# Altium project eDP_adapter_dvt1.PrjPcb
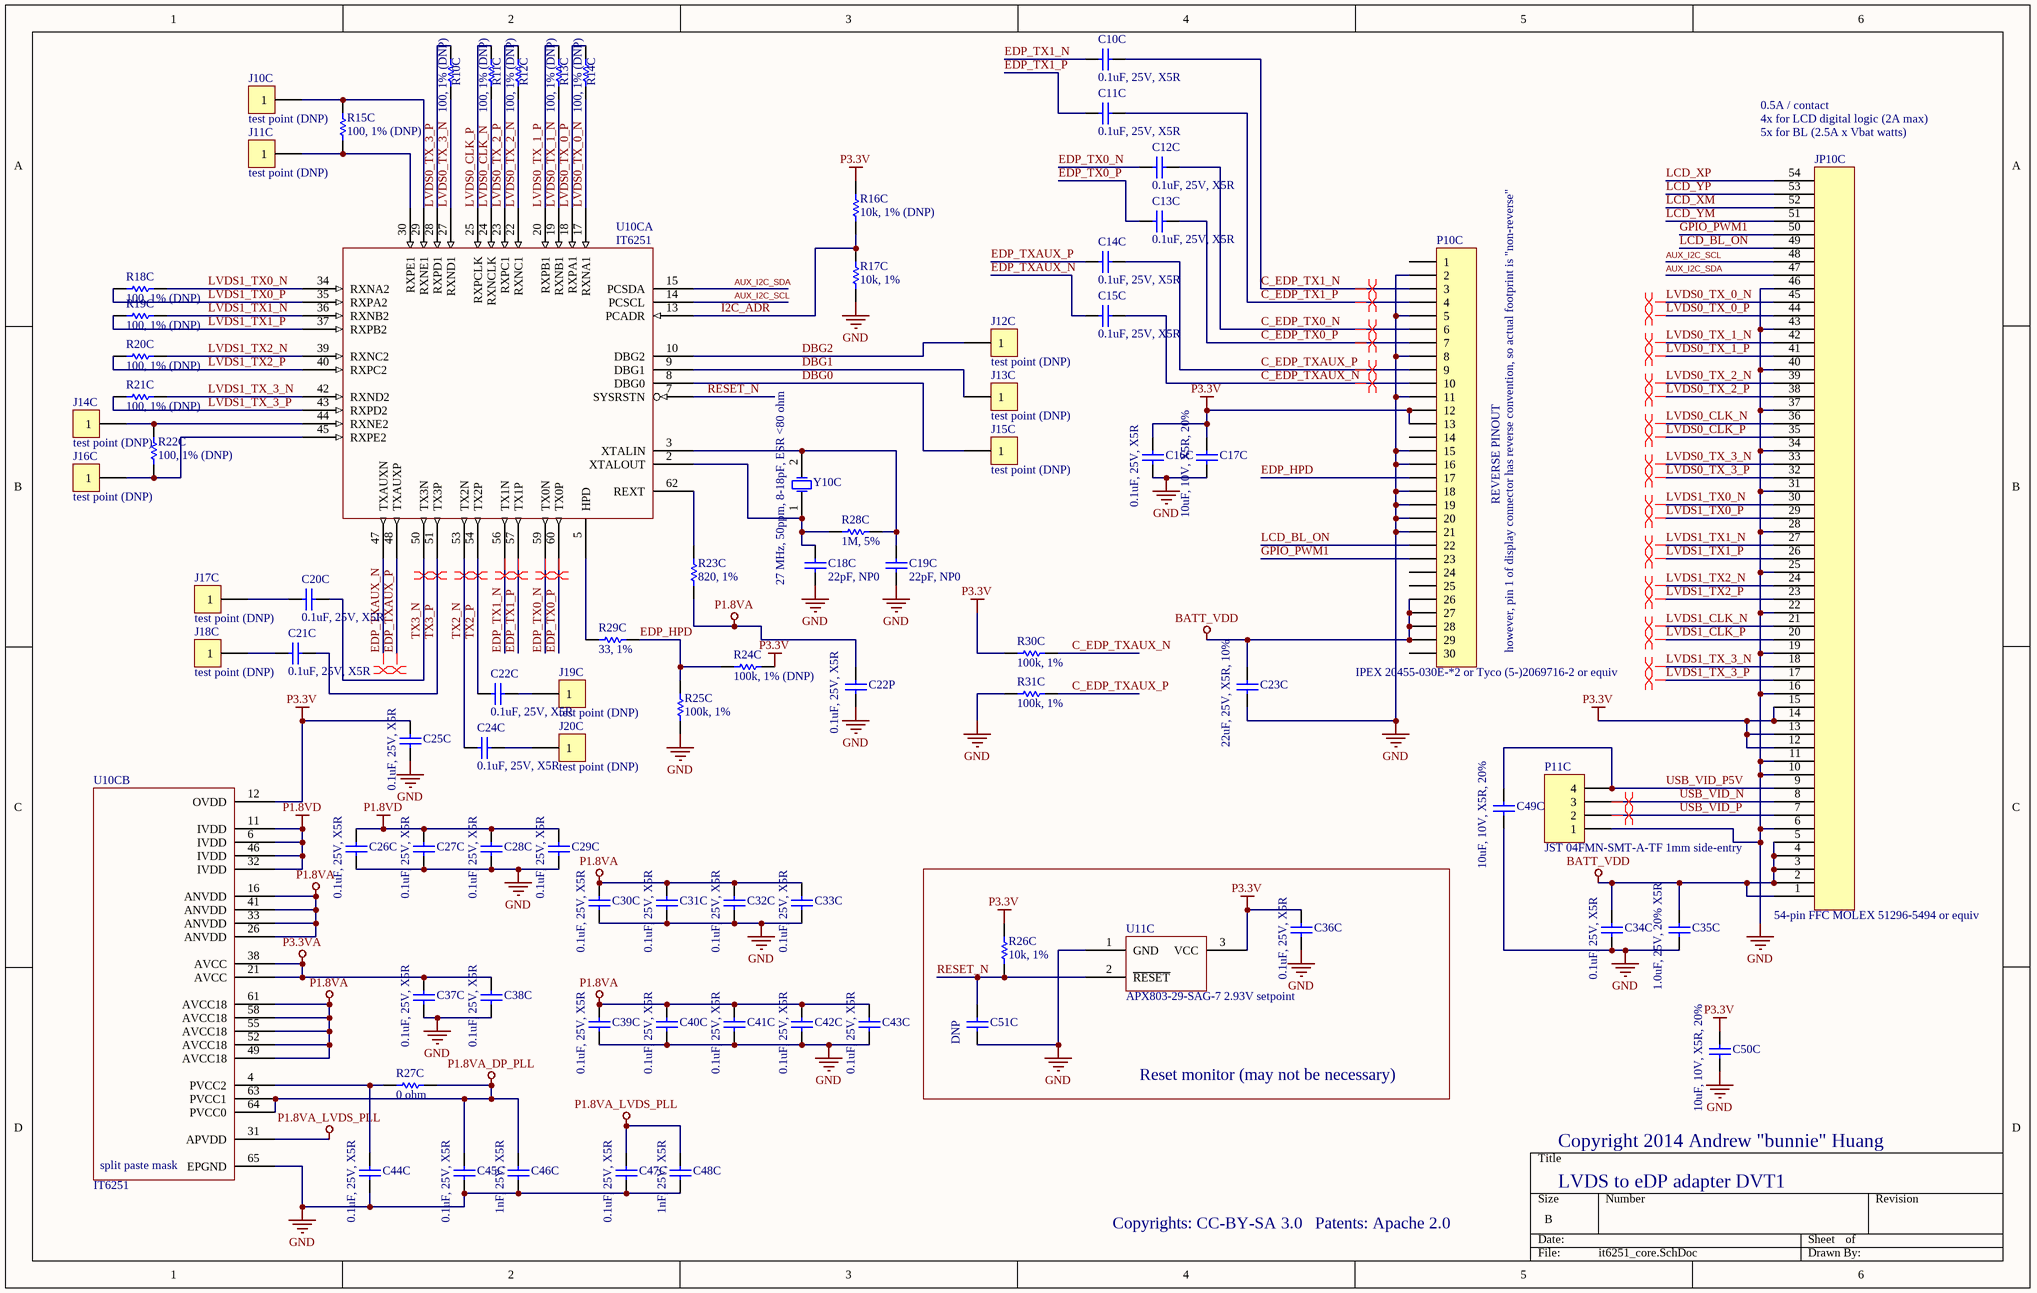
[diagram p0: it6251_core.SchDoc]
2 sheets, 112 parts. Net scope: global (net labels, ports and power ports of the same name join across sheets).
Board file: eDP_adapter_dvt1.PcbDoc
Sheets:
  it6251_core.SchDoc
  power.SchDoc

## Sheet it6251_core.SchDoc
size B

### Parts
C10C  0.1uF, 25V, X5R  [CAPC1005N]
C11C  0.1uF, 25V, X5R  [CAPC1005N]
C12C  0.1uF, 25V, X5R  [CAPC1005N]
C13C  0.1uF, 25V, X5R  [CAPC1005N]
C14C  0.1uF, 25V, X5R  [CAPC1005N]
C15C  0.1uF, 25V, X5R  [CAPC1005N]
C16C  0.1uF, 25V, X5R  [CAPC1005N]
C17C  10uF, 10V, X5R, 20%  [CAPC1608N]
C18C  22pF, NP0  [CAPC1005N]
C19C  22pF, NP0  [CAPC1005N]
C20C  0.1uF, 25V, X5R  [CAPC1005N]
C21C  0.1uF, 25V, X5R  [CAPC1005N]
C22C  0.1uF, 25V, X5R  [CAPC1005N]
C22P  0.1uF, 25V, X5R  [CAPC1005N]
C23C  22uF, 25V, X5R, 10%  [CAPC3225N]
C24C  0.1uF, 25V, X5R  [CAPC1005N]
C25C  0.1uF, 25V, X5R  [CAPC1005N]
C26C  0.1uF, 25V, X5R  [CAPC1005N]
C27C  0.1uF, 25V, X5R  [CAPC1005N]
C28C  0.1uF, 25V, X5R  [CAPC1005N]
C29C  0.1uF, 25V, X5R  [CAPC1005N]
C30C  0.1uF, 25V, X5R  [CAPC1005N]
C31C  0.1uF, 25V, X5R  [CAPC1005N]
C32C  0.1uF, 25V, X5R  [CAPC1005N]
C33C  0.1uF, 25V, X5R  [CAPC1005N]
C34C  0.1uF, 25V, X5R  [CAPC1005N]
C35C  1.0uF, 25V, 20% X5R  [CAPC1608N]
C36C  0.1uF, 25V, X5R  [CAPC1005N]
C37C  0.1uF, 25V, X5R  [CAPC1005N]
C38C  0.1uF, 25V, X5R  [CAPC1005N]
C39C  0.1uF, 25V, X5R  [CAPC1005N]
C40C  0.1uF, 25V, X5R  [CAPC1005N]
C41C  0.1uF, 25V, X5R  [CAPC1005N]
C42C  0.1uF, 25V, X5R  [CAPC1005N]
C43C  0.1uF, 25V, X5R  [CAPC1005N]
C44C  0.1uF, 25V, X5R  [CAPC1005N]
C45C  0.1uF, 25V, X5R  [CAPC1005N]
C46C  1nF, 25V, X5R  [CAPC1005N]
C47C  0.1uF, 25V, X5R  [CAPC1005N]
C48C  1nF, 25V, X5R  [CAPC1005N]
C49C  10uF, 10V, X5R, 20%  [CAPC1608N]
C50C  10uF, 10V, X5R, 20%  [CAPC1608N]
C51C  DNP  [CAPC1608N]
J10C  test point (DNP)  [TP_SMT_38mil]
J11C  test point (DNP)  [TP_SMT_38mil]
J12C  test point (DNP)  [TP_SMT_38mil]
J13C  test point (DNP)  [TP_SMT_38mil]
J14C  test point (DNP)  [TP_SMT_38mil]
J15C  test point (DNP)  [TP_SMT_38mil]
J16C  test point (DNP)  [TP_SMT_38mil]
J17C  test point (DNP)  [TP_SMT_38mil]
J18C  test point (DNP)  [TP_SMT_38mil]
J19C  test point (DNP)  [TP_SMT_38mil]
J20C  test point (DNP)  [TP_SMT_38mil]
JP10C  54-pin FFC MOLEX 51296-5494 or equiv  [MOLEX_51296_5494]
P10C  IPEX 20455-030E-*2 or Tyco (5-)2069716-2 or equiv  [TYCO_5-2069716-2]
P11C  JST 04FMN-SMT-A-TF 1mm side-entry  [JST_04FMN_SMT_A_TF]
R10C  100, 1% (DNP)  [RESC0603N]
R11C  100, 1% (DNP)  [RESC0603N]
R12C  100, 1% (DNP)  [RESC0603N]
R13C  100, 1% (DNP)  [RESC0603N]
R14C  100, 1% (DNP)  [RESC0603N]
R15C  100, 1% (DNP)  [RESC0603N]
R16C  10k, 1% (DNP)  [RESC1005N]
R17C  10k, 1%  [RESC1005N]
R18C  100, 1% (DNP)  [RESC0603N]
R19C  100, 1% (DNP)  [RESC0603N]
R20C  100, 1% (DNP)  [RESC0603N]
R21C  100, 1% (DNP)  [RESC0603N]
R22C  100, 1% (DNP)  [RESC0603N]
R23C  820, 1%  [RESC1005N]
R24C  100k, 1% (DNP)  [RESC1005N]
R25C  100k, 1%  [RESC1005N]
R26C  10k, 1%  [RESC1005N]
R27C  0 ohm  [RESC1005N]
R28C  1M, 5%  [RESC1005N]
R29C  33, 1%  [RESC1005N]
R30C  100k, 1%  [RESC1005N]
R31C  100k, 1%  [RESC1005N]
U10C  IT6251  [QFN50P900X900-64WAN]  (parts A,B of 2)
U11C  APX803-29-SAG-7 2.93V setpoint  [SOT23-3N]
Y10C  27 MHz, 50ppm, 8-18pF, ESR <80 ohm  [NDK_NX5032A]

### Blocks framed on the sheet
Reset monitor (may not be necessary): C36C C51C R26C U11C

### Nets
BATT_VDD: C23C.1 C34C.1 C35C.1 JP10C.1 JP10C.2 JP10C.3 JP10C.4 JP10C.5 P10C.26 P10C.27 P10C.28 P10C.29
GND: C16C.2 C17C.1 C18C.1 C19C.1 C22P.1 C23C.2 C25C.2 C26C.2 C27C.2 C28C.2 C29C.2 C30C.2 C31C.2 C32C.2 C33C.2 C34C.2 C35C.2 C36C.2 C37C.2 C38C.2 C39C.2 C40C.2 C41C.2 C42C.2 C43C.2 C44C.2 C45C.2 C46C.2 C47C.2 C48C.2 C49C.1 C50C.1 C51C.2 JP10C.6 JP10C.10 JP10C.11 JP10C.16 JP10C.19 JP10C.22 JP10C.25 JP10C.28 JP10C.31 JP10C.34 JP10C.37 JP10C.40 JP10C.43 JP10C.46 P10C.2 P10C.5 P10C.8 P10C.11 P10C.15 P10C.16 P10C.18 P10C.19 P10C.20 P10C.21 P11C.1 R17C.2 R25C.2 R31C.2 U10C.65(EPGND) U11C.1(GND)
P1.8VA: C22P.2 C30C.1 C31C.1 C32C.1 C33C.1 C39C.1 C40C.1 C41C.1 C42C.1 C43C.1 R23C.2 U10C.16(ANVDD) U10C.26(ANVDD) U10C.33(ANVDD) U10C.41(ANVDD) U10C.49(AVCC18) U10C.52(AVCC18) U10C.55(AVCC18) U10C.58(AVCC18) U10C.61(AVCC18)
P1.8VA_DP_PLL: C45C.1 C46C.1 R27C.1 U10C.63(PVCC1) U10C.64(PVCC0)
P1.8VA_LVDS_PLL: C47C.1 C48C.1 U10C.31(APVDD)
P1.8VD: C26C.1 C27C.1 C28C.1 C29C.1 U10C.6(IVDD) U10C.11(IVDD) U10C.32(IVDD) U10C.46(IVDD)
P3.3V: C16C.1 C17C.2 C25C.1 C36C.1 C50C.2 JP10C.12 JP10C.13 JP10C.14 JP10C.15 P10C.12 P10C.13 R16C.1 R24C.1 R26C.1 R30C.2 U10C.12(OVDD) U11C.3(VCC)
P3.3VA: C37C.1 C38C.1 U10C.21(AVCC) U10C.38(AVCC)
AUX_I2C_SCL: JP10C.48 U10C.14(PCSCL)
AUX_I2C_SDA: JP10C.47 U10C.15(PCSDA)
C_EDP_TX0_N: C12C.1 P10C.6
C_EDP_TX0_P: C13C.1 P10C.7
C_EDP_TX1_N: C10C.1 P10C.3
C_EDP_TX1_P: C11C.1 P10C.4
C_EDP_TXAUX_N: C15C.1 P10C.10 R30C.1
C_EDP_TXAUX_P: C14C.1 P10C.9 R31C.1
DBG0: J15C.1 U10C.8(DBG0)
DBG1: J13C.1 U10C.9(DBG1)
DBG2: J12C.1 U10C.10(DBG2)
EDP_HPD: P10C.17 R24C.2 R25C.1 R29C.2
EDP_TX0_N: C12C.2 U10C.59(TX0N)
EDP_TX0_P: C13C.2 U10C.60(TX0P)
EDP_TX1_N: C10C.2 U10C.56(TX1N)
EDP_TX1_P: C11C.2 U10C.57(TX1P)
EDP_TXAUX_N: C15C.2 U10C.47(TXAUXN)
EDP_TXAUX_P: C14C.2 U10C.48(TXAUXP)
GPIO_PWM1: JP10C.50 P10C.23
I2C_ADR: R16C.2 R17C.1 U10C.13(PCADR)
LCD_BL_ON: JP10C.49 P10C.22
LCD_XM: JP10C.52
LCD_XP: JP10C.54
LCD_YM: JP10C.51
LCD_YP: JP10C.53
LVDS0_CLK_N: JP10C.36 R11C.2 U10C.24(RXNCLK)
LVDS0_CLK_P: JP10C.35 R11C.1 U10C.25(RXPCLK)
LVDS0_TX_0_N: JP10C.45 R14C.2 U10C.17(RXNA1)
LVDS0_TX_0_P: JP10C.44 R14C.1 U10C.18(RXPA1)
LVDS0_TX_1_N: JP10C.42 R13C.2 U10C.19(RXNB1)
LVDS0_TX_1_P: JP10C.41 R13C.1 U10C.20(RXPB1)
LVDS0_TX_2_N: JP10C.39 R12C.2 U10C.22(RXNC1)
LVDS0_TX_2_P: JP10C.38 R12C.1 U10C.23(RXPC1)
LVDS0_TX_3_N: JP10C.33 R10C.2 U10C.27(RXND1)
LVDS0_TX_3_P: JP10C.32 R10C.1 U10C.28(RXPD1)
LVDS1_CLK_N: JP10C.21
LVDS1_CLK_P: JP10C.20
LVDS1_TX0_N: JP10C.30 R18C.1 U10C.34(RXNA2)
LVDS1_TX0_P: JP10C.29 R18C.2 U10C.35(RXPA2)
LVDS1_TX1_N: JP10C.27 R19C.1 U10C.36(RXNB2)
LVDS1_TX1_P: JP10C.26 R19C.2 U10C.37(RXPB2)
LVDS1_TX2_N: JP10C.24 R20C.1 U10C.39(RXNC2)
LVDS1_TX2_P: JP10C.23 R20C.2 U10C.40(RXPC2)
LVDS1_TX_3_N: JP10C.18 R21C.1 U10C.42(RXND2)
LVDS1_TX_3_P: JP10C.17 R21C.2 U10C.43(RXPD2)
RESET_N: C51C.1 R26C.2 U10C.7(SYSRSTN) U11C.2(~{RESET})
TX2_N: C24C.2 U10C.53(TX2N)
TX2_P: C22C.2 U10C.54(TX2P)
TX3_N: C20C.1 U10C.50(TX3N)
TX3_P: C21C.1 U10C.51(TX3P)
USB_VID_N: JP10C.8 P11C.3
USB_VID_P: JP10C.7 P11C.2
USB_VID_P5V: C49C.2 JP10C.9 P11C.4
NetC18C_2: C18C.2 R28C.2 U10C.2(XTALOUT) Y10C.1(OSC1)
NetC19C_2: C19C.2 R28C.1 U10C.3(XTALIN) Y10C.2(OSC2)
NetC20C_2: C20C.2 J17C.1
NetC21C_2: C21C.2 J18C.1
NetC22C_1: C22C.1 J19C.1
NetC24C_1: C24C.1 J20C.1
NetC44C_1: C44C.1 R27C.2 U10C.4(PVCC2)
NetJ10C_1: J10C.1 R15C.2 U10C.29(RXNE1)
NetJ11C_1: J11C.1 R15C.1 U10C.30(RXPE1)
NetJ14C_1: J14C.1 R22C.2 U10C.44(RXNE2)
NetJ16C_1: J16C.1 R22C.1 U10C.45(RXPE2)
NetR23C_1: R23C.1 U10C.62(REXT)
NetR29C_1: R29C.1 U10C.5(HPD)

Not connected (* = marked no-connect by the designer): P10C 1 14 24 25 30

### Layout directives
differential pair: C_EDP_TX0_N, C_EDP_TX0_P, C_EDP_TX1_N, C_EDP_TX1_P, C_EDP_TXAUX_N, C_EDP_TXAUX_P, EDP_TX0_N, EDP_TX0_P, EDP_TX1_N, EDP_TX1_P, EDP_TXAUX_N, EDP_TXAUX_P, LVDS0_CLK_N, LVDS0_CLK_P, LVDS0_TX_0_N, LVDS0_TX_0_P, LVDS0_TX_1_N, LVDS0_TX_1_P, LVDS0_TX_2_N, LVDS0_TX_2_P, LVDS0_TX_3_N, LVDS0_TX_3_P, LVDS1_CLK_N, LVDS1_CLK_P, LVDS1_TX0_N, LVDS1_TX0_P, LVDS1_TX1_N, LVDS1_TX1_P, LVDS1_TX2_N, LVDS1_TX2_P, LVDS1_TX_3_N, LVDS1_TX_3_P, TX2_N, TX2_P, TX3_N, TX3_P, USB_VID_N, USB_VID_P

### Notes on the sheet
- 0.5A / contact
- 4x for LCD digital logic (2A max)
- (near JP10C) 5x for BL (2.5A x Vbat watts)
- REVERSE PINOUT
- however, pin 1 of display connector has reverse convention, so actual footprint is "non-reverse"
- Copyright 2014 Andrew "bunnie" Huang
- Copyrights: CC-BY-SA 3.0
- Patents: Apache 2.0
- LVDS to eDP adapter DVT1
- (in symbol IT6251, part B) split paste mask

### Library data of the parts
C10C C11C C12C C13C C14C C15C C16C C17C C18C C19C C20C C21C C22C C22P C23C C24C C25C C26C C27C C28C C29C C30C C31C C32C C33C C34C C35C C36C C37C C38C C39C C40C C41C C42C C43C C44C C45C C46C C47C C48C C49C C50C C51C = Cap Semi: Capacitor (Semiconductor SIM Model); Published: 8-Jun-2000; LatestRevisionDate: 17-Jul-2002; LatestRevisionNote: Re-released for DXP Platform.; PackageReference: C1206; Publisher: Altium Limited
J10C J11C J12C J13C J14C J15C J16C J17C J18C J19C J20C = CON1: Connector
JP10C = HEADER_54: Flat flex connector, 54 positions
P10C = Header 30: LatestRevisionDate: 17-Jul-2002; LatestRevisionNote: Re-released for DXP Platform.; Publisher: Altium Limited
P11C = Header 4: Header, 4-Pin; LatestRevisionDate: 17-Jul-2002; LatestRevisionNote: Re-released for DXP Platform.; Publisher: Altium Limited
R10C R11C R12C R13C R14C R15C R16C R17C R18C R19C R20C R21C R22C R23C R26C R27C R28C R29C = Res1: Resistor; Value: 100k; Published: 8-Jun-2000; LatestRevisionDate: 17-Jul-2002; LatestRevisionNote: Re-released for DXP Platform.; PackageReference: AXIAL-0.3; Publisher: Altium Limited
R24C R25C R30C R31C = Res1: Resistor; Published: 8-Jun-2000; LatestRevisionDate: 17-Jul-2002; LatestRevisionNote: Re-released for DXP Platform.; PackageReference: AXIAL-0.3; Publisher: Altium Limited; Value: 100k
U10C = IT6251: LVDS to eDP converter
U11C = RESET_SOT23: Reset monitor. Voltage specified by XX in P/N. Multiple vendors.
Y10C = XTAL: Crystal Oscillator; Published: 8-Jun-2000; LatestRevisionDate: 17-Jul-2002; LatestRevisionNote: Re-released for DXP Platform.; PackageReference: R38; Publisher: Altium Limited

## Sheet power.SchDoc
size A
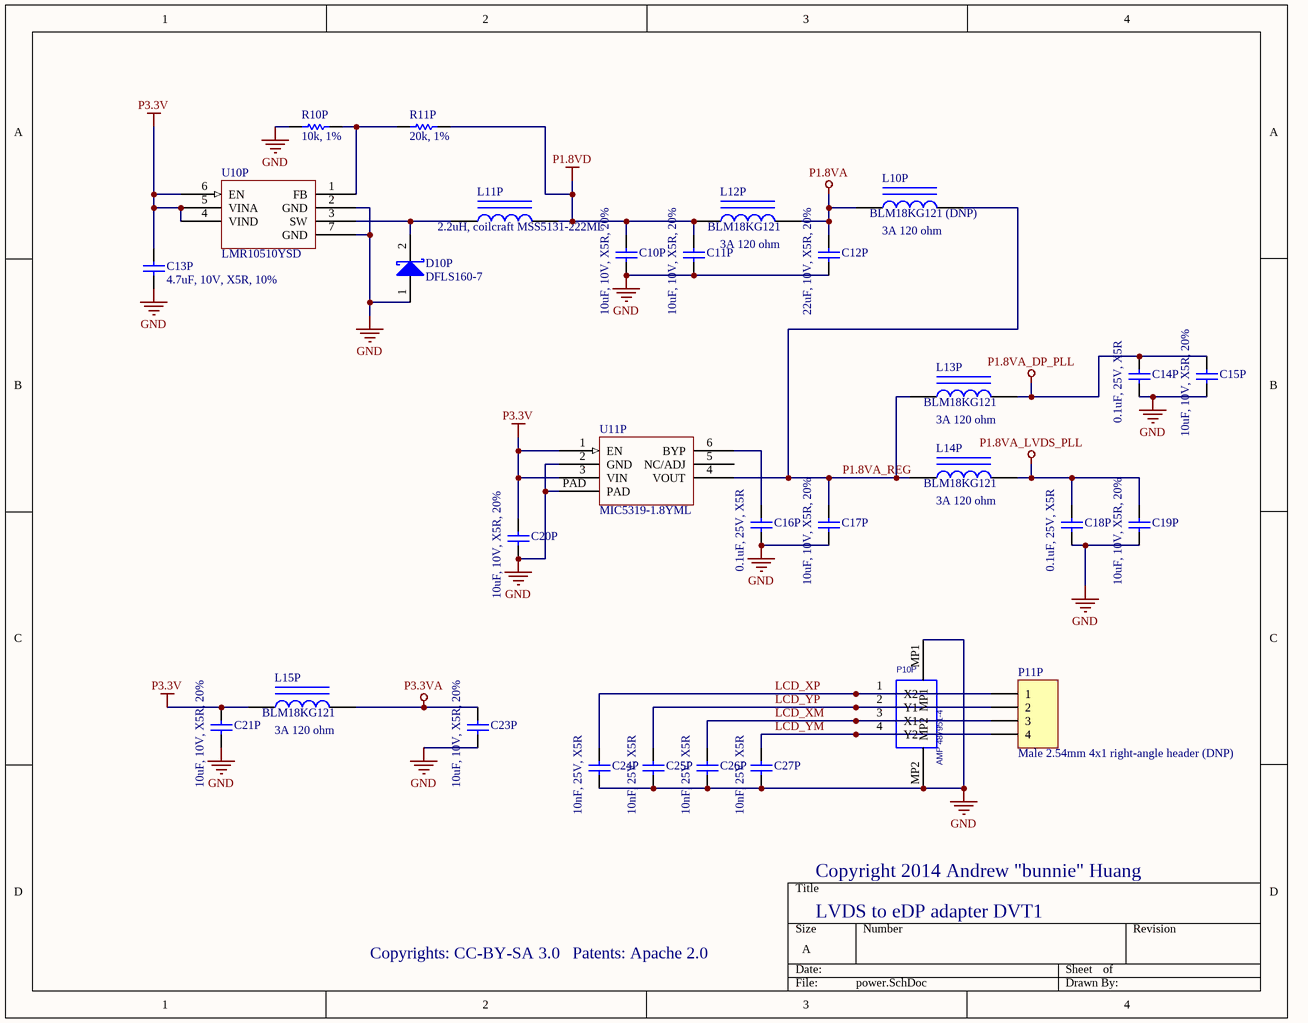
[diagram p1: power.SchDoc]

### Parts
C10P  10uF, 10V, X5R, 20%  [CAPC1608N]
C11P  10uF, 10V, X5R, 20%  [CAPC1608N]
C12P  22uF, 10V, X5R, 20%  [CAPC2012N]
C13P  4.7uF, 10V, X5R, 10%  [CAPC1608N]
C14P  0.1uF, 25V, X5R  [CAPC1005N]
C15P  10uF, 10V, X5R, 20%  [CAPC1608N]
C16P  0.1uF, 25V, X5R  [CAPC1005N]
C17P  10uF, 10V, X5R, 20%  [CAPC1608N]
C18P  0.1uF, 25V, X5R  [CAPC1005N]
C19P  10uF, 10V, X5R, 20%  [CAPC1608N]
C20P  10uF, 10V, X5R, 20%  [CAPC1608N]
C21P  10uF, 10V, X5R, 20%  [CAPC1608N]
C23P  10uF, 10V, X5R, 20%  [CAPC1608N]
C24P  10nF, 25V, X5R  [CAPC1005N]
C25P  10nF, 25V, X5R  [CAPC1005N]
C26P  10nF, 25V, X5R  [CAPC1005N]
C27P  10nF, 25V, X5R  [CAPC1005N]
D10P  DFLS160-7  [POWERDI-123]
L10P  BLM18KG121 (DNP)  value 3A 120 ohm  [INDC1608AN]
L11P  2.2uH, coilcraft MSS5131-222ML  [COILCRAFT_MSS5121]
L12P  BLM18KG121  value 3A 120 ohm  [INDC1608AN]
L13P  BLM18KG121  value 3A 120 ohm  [INDC1608AN]
L14P  BLM18KG121  value 3A 120 ohm  [INDC1608AN]
L15P  BLM18KG121  value 3A 120 ohm  [INDC1608AN]
P10P  AMP 487951-4  [AMP_487951_4]
P11P  Male 2.54mm 4x1 right-angle header (DNP)  [HDR1X4H]
R10P  10k, 1%  [RESC1005N]
R11P  20k, 1%  [RESC1005N]
U10P  LMR10510YSD  [SON95P300X300X80-7V]
U11P  MIC5319-1.8YML  [MICREL_MLF2x2_6]

### Nets
GND: C10P.1 C11P.1 C12P.2 C13P.2 C14P.1 C15P.1 C16P.1 C17P.1 C18P.1 C19P.1 C20P.1 C21P.1 C23P.1 C24P.1 C25P.1 C26P.1 C27P.1 D10P.1(A) P10P.MP1 P10P.MP2 R10P.2 U10P.2(GND) U10P.7(GND) U11P.2(GND) U11P.PAD
P1.8VA: C12P.1 L10P.1 L12P.2
P1.8VA_DP_PLL: C14P.2 C15P.2 L13P.2
P1.8VA_LVDS_PLL: C18P.2 C19P.2 L14P.2
P1.8VD: C10P.2 C11P.2 L11P.2 L12P.1 R11P.1
P3.3V: C13P.1 C20P.2 C21P.2 L15P.1 U10P.4(VIND) U10P.5(VINA) U10P.6(EN) U11P.1(EN) U11P.3(VIN)
P3.3VA: C23P.2 L15P.2
LCD_XM: C26P.2 P10P.3(X1) P11P.3
LCD_XP: C24P.2 P10P.1(X2) P11P.1
LCD_YM: C27P.2 P10P.4(Y2) P11P.4
LCD_YP: C25P.2 P10P.2(Y1) P11P.2
P1.8VA_REG: C17P.2 L10P.2 L13P.1 L14P.1 U11P.4(VOUT)
NetC16P_2: C16P.2 U11P.6(BYP)
NetD10P_2: D10P.2(K) L11P.1 U10P.3(SW)
NetR10P_1: R10P.1 R11P.2 U10P.1(FB)

Not connected (* = marked no-connect by the designer): U11P 5(NC/ADJ)

### Notes on the sheet
- Copyright 2014 Andrew "bunnie" Huang
- Copyrights: CC-BY-SA 3.0
- Patents: Apache 2.0
- LVDS to eDP adapter DVT1

### Library data of the parts
C10P C11P C12P C13P C14P C15P C16P C17P C18P C19P C20P C21P C23P C24P C25P C26P C27P = Cap Semi: Capacitor (Semiconductor SIM Model); Published: 8-Jun-2000; LatestRevisionDate: 17-Jul-2002; LatestRevisionNote: Re-released for DXP Platform.; PackageReference: C1206; Publisher: Altium Limited
D10P = D Schottky: Schottky Diode; Code - JEDEC: DO-214-AA; Published: 8-Jun-2000; Publisher: Altium Limited; Revision: July-2002: Re-released for DXP Platform.
L10P L11P L12P L13P L14P L15P = Inductor Iron: Magnetic-Core Inductor; Published: 24-Mar-1999; LatestRevisionDate: 17-Jul-2002; LatestRevisionNote: Re-released for DXP Platform.; PackageReference: AXIAL-0.9; Publisher: Altium Limited
P10P = TFT_TP_CON: Right: 30; Bottom: 50
P11P = Header 4H: Header, 4-Pin, Right Angle; LatestRevisionDate: 17-Jul-2002; LatestRevisionNote: Re-released for DXP Platform.; Publisher: Altium Limited
R10P R11P = Res1: Resistor; Value: 100k; Published: 8-Jun-2000; LatestRevisionDate: 17-Jul-2002; LatestRevisionNote: Re-released for DXP Platform.; PackageReference: AXIAL-0.3; Publisher: Altium Limited
U10P = LMR10515XSD: NatSemi 1.5A step-down regulator in LLP
U11P = MIC5319-XXYML: 500 mA uCap ultra-low dropout high PSRR LDO regulator

## Nets that join several sheets
GND: it6251_core (63 pins), power (25 pins)
P1.8VA: it6251_core (20 pins), power (C12P.1 L10P.1 L12P.2)
P1.8VA_DP_PLL: it6251_core (5 pins), power (C14P.2 C15P.2 L13P.2)
P1.8VA_LVDS_PLL: it6251_core (C47C.1 C48C.1 U10C.31), power (C18P.2 C19P.2 L14P.2)
P1.8VD: it6251_core (8 pins), power (5 pins)
P3.3V: it6251_core (17 pins), power (9 pins)
P3.3VA: it6251_core (C37C.1 C38C.1 U10C.21 U10C.38), power (C23P.2 L15P.2)
LCD_XM: it6251_core (JP10C.52), power (C26P.2 P10P.3 P11P.3)
LCD_XP: it6251_core (JP10C.54), power (C24P.2 P10P.1 P11P.1)
LCD_YM: it6251_core (JP10C.51), power (C27P.2 P10P.4 P11P.4)
LCD_YP: it6251_core (JP10C.53), power (C25P.2 P10P.2 P11P.2)